# EAGLE design OSO-MISC-21-017 Sensor Watch Flash (EAGLE 9.6.2)
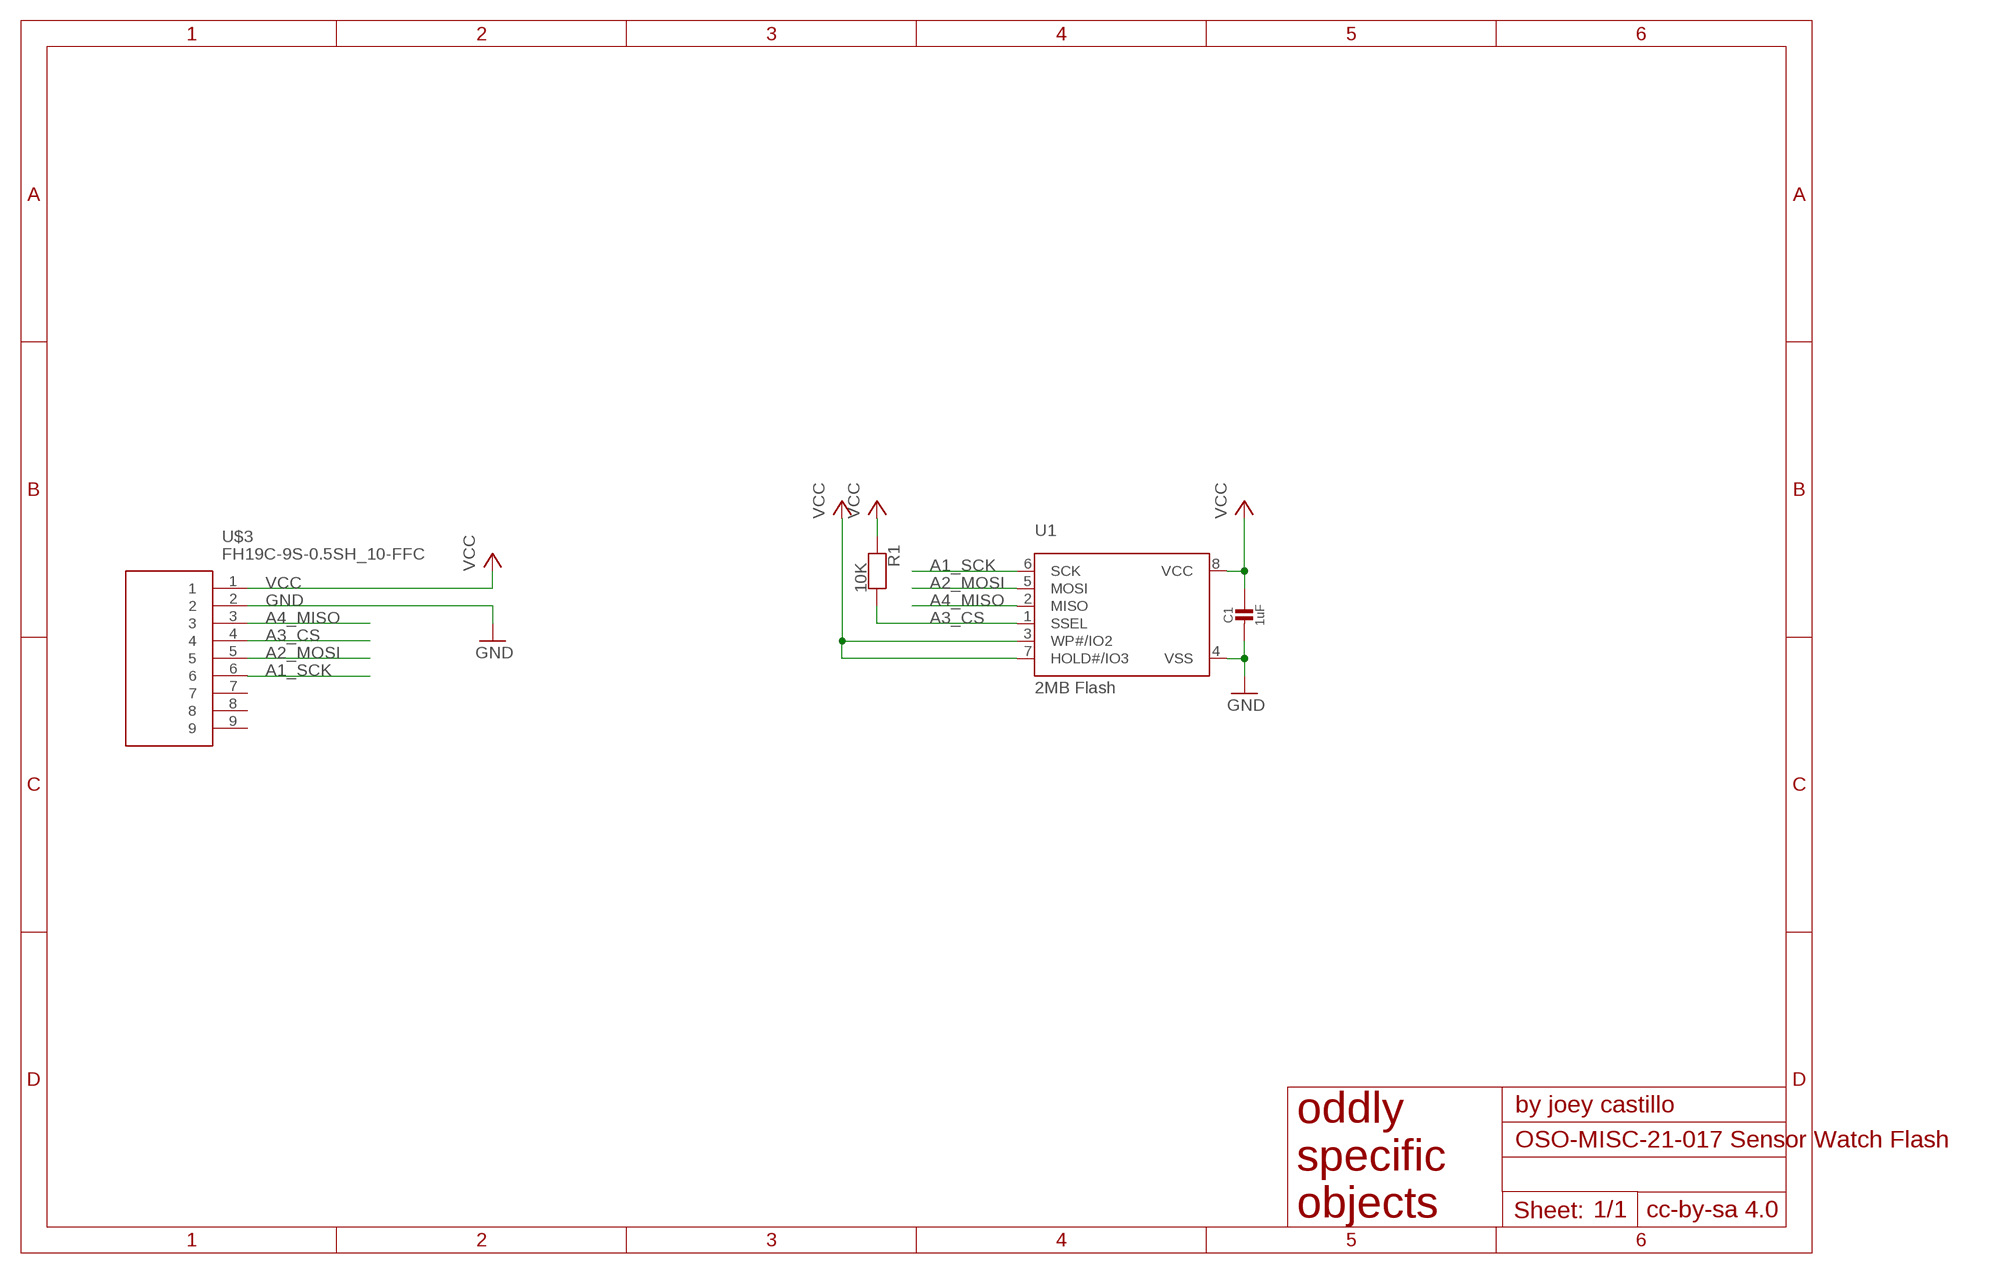
[diagram p0: schematic, sheet 1]

## Parts
C1  1uF  CAP_CERAMIC_0603MP  [_0603MP]
R1  10K  RESISTOR_0603MP  [_0603MP]
U1  2MB Flash  SPIFLASH_8PINUX  [USON8]
U$3  FH19C-9S-0.5SH_10-FFC  [FH19C9S05SH10-FFC]

## Nets
A1_SCK: U1.6(SCK) U$3.6
A2_MOSI: U1.5(MOSI) U$3.5
A3_CS: R1.2 U1.1(SSEL) U$3.4
A4_MISO: U1.2(MISO) U$3.3
GND [gnd]: C1.2 U1.4(VSS) U$3.2
VCC [power]: C1.1 R1.1 U1.3(WP#/IO2) U1.7(HOLD#/IO3) U1.8(VCC) U$3.1
Unconnected: U$3.7 U$3.8 U$3.9

## Library data of the parts
C1 = microbuilder:CAP_CERAMIC: Ceramic Capacitors For new designs, use the packages preceded by an '_' character since they are more reliable: The following footprints should be used on most boards: _0402 - Standard footprint for regular board layouts _0603 - Standard footprint for regular board layouts _0805 - Standard footprint for regular board layouts _1206 - Standard footprint for regular board layouts For extremely tight-pitch boards where space is at a premium, the following 'micro-pitch' footprints can be used (smaller pads, no silkscreen outline, etc.): _0402MP - Micro-pitch footprint for very dense/compact boards _0603MP - Micro-pitch footprint for very dense/compact boards _0805MP - Micro-pitch footprint for very dense/compact boards _1206MP - Micro-pitch footprint for very dense/compact boards
R1 = microbuilder:RESISTOR: Resistors For new designs, use the packages preceded by an '_' character since they are more reliable: The following footprints should be used on most boards: _0402 - Standard footprint for regular board layouts _0603 - Standard footprint for regular board layouts _0805 - Standard footprint for regular board layouts _1206 - Standard footprint for regular board layouts For extremely tight-pitch boards where space is at a premium, the following 'micro-pitch' footprints can be used (smaller pads, no silkscreen outline, etc.): _0402MP - Micro-pitch footprint for very dense/compact boards _0603MP - Micro-pitch footprint for very dense/compact boards _0805MP - Micro-pitch footprint for very dense/compact boards _1206MP - Micro-pitch footprint for very dense/compact boards
U1 = microbuilder:SPIFLASH_8PIN: SOIC8 SPI Flash Be careful with the size since SOIC8 flash comes in several 'widths' SOIC8 150 mil M25P16 - 16Mbit (2Mbit x 8) Serial Flash (75MHz SPI Bus), Supply: 2.7-3.6V Digikey: SOIC8 - M25P16-VMN6P-ND SOIC8 208 mil W25Q16BVSSIG - 16Mbit (2Mbit x 8) Serial Flash (104MHz SPI Bus), Supply: 2.7-3.6V Digikey: SOIC8 - W25Q16BVSSIG-ND
U$3 = FH19C-9S-0.5SH:FH19C-9S-0.5SH_10-FFC

## Net classes
0 default: width 0.203 mm
1 power: width 0.203 mm
2 gnd: width 0.203 mm

## Board
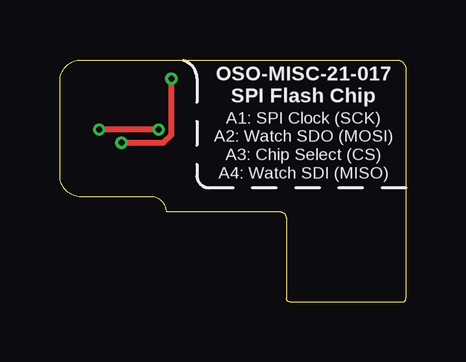
[diagram p1: board, top side]
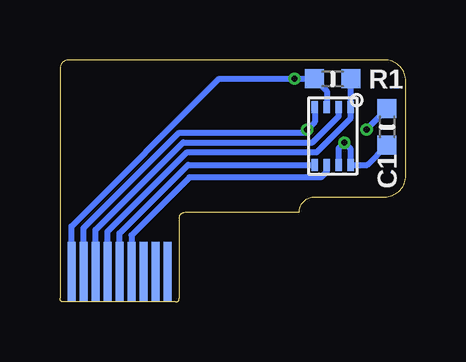
[diagram p2: board, bottom side, seen from below]

Size 14.43 x 10.1 mm. Coordinates in mm from the lower left corner, seen from the top.
Outline: 9.45,3.5 arc90 9.2,3.75 4.45,3.75 arc90 3.81,4.39 0.89,4.39 arc-90 0,5.28 0,9.21 arc-90 0.89,10.1 14.05,10.1 arc-90 14.43,9.72 14.43,3.5
Copper layers (1*16): Top 0.035559375mm / dielectric 1.6mm / Bottom 0.035559375mm
Design rules "oshpark-2layer *": minimum track width 6mil, minimum drill 10mil, track to track 6mil, track to pad 6mil, pad to pad 6mil, via to via 6mil, smd to smd 6mil, copper to edge 15mil, drill to drill 6mil, minimum pad ring 5mil, minimum via ring 5mil, stop-mask expansion 2.5mil, vias tented up to drill 12mil, thermal gap 10mil

### Footprints (pad centres in the part's own frame; a part is rotated, then mirrored left to right if it is on the bottom)
_0603MP = smd 0.8 x 0.8: 1 -0.762,0; 2 0.762,0
USON8 = smd 0.5 x 0.275: 1 -1.2,0.75; 2 -1.2,0.25; 3 -1.2,-0.25; 4 -1.2,-0.75; 5 1.2,-0.75; 6 1.2,-0.25; 7 1.2,0.25; 8 1.2,0.75
FH19C9S05SH10-FFC = smd 0.347 x 2.5 bottom: 1 2,-2.25; 2 1.5,-2.25; 3 1,-2.25; 4 0.5,-2.25; 5 0,-2.25; 6 -0.5,-2.25; 7 -1,-2.25; 8 -1.5,-2.25; 9 -2,-2.25

### Placement (x,y rotation side)
C1  0.79,7.31 90 bottom
R1  3.05,9.32 0 bottom
U1  3.05,6.93 270 bottom
U$3  11.94,3.5 0 top

### Tracks (layer width: path | path; a pad name or v marks a point on that pad's centre or on a via)
A1_SCK
  Bottom 0.254: U1.6 3.3,5.45 3.54,5.2 9.03,5.2 11.44,2.79 U$3.6
A2_MOSI
  Bottom 0.254: U$3.5 11.94,2.87 9.07,5.73 U1.5
A3_CS
  Bottom 0.254: U$3.4 12.44,2.94 9.12,6.26 3.72,6.26 2.3,7.68 U1.1 R1.2
A4_MISO
  Bottom 0.254: U$3.3 12.94,3.01 9.29,6.67 3.89,6.67 2.8,7.75 U1.2
GND  (via drill 0.25)
  Top 0.254: v4.12,7.2 v1.64,7.2
  Bottom 0.254: U$3.2 13.44,3.09 9.46,7.07 4.24,7.07 v4.12,7.2 3.8,7.52 U1.4 | C1.2 0.79,8.05 v1.64,7.2
VCC  (via drill 0.25)
  Top 0.254: v2.57,6.65 4.32,6.65 4.65,6.98 v4.65,9.32
  Bottom 0.254: U1.3 3.3,8.8 R1.1 v4.65,9.32 7.79,9.32 13.94,3.16 U$3.1 | U1.7 2.8,6.42 v2.57,6.65 2.3,6.38 U1.8 1.61,5.73 C1.1

### Text on the board
tPlace: OSO-MISC-21-017 / SPI Flash Chip | A1: SPI Clock (SCK) / A2: Watch SDO (MOSI) / A3: Chip Select (CS) / A4: Watch SDI (MISO)